# Altium schematic sheet CAN.SchDoc: Arm - CAN Transcievers
size Letter; DrawnBy: P.Onaifo, K.Hong; Organization: UW Robotics; Address1: 200 University Avenue; Address2: Waterloo; Address3: Ontario; Address4: Canada N2L 3G6; SheetNumber: 2; SheetTotal: 9
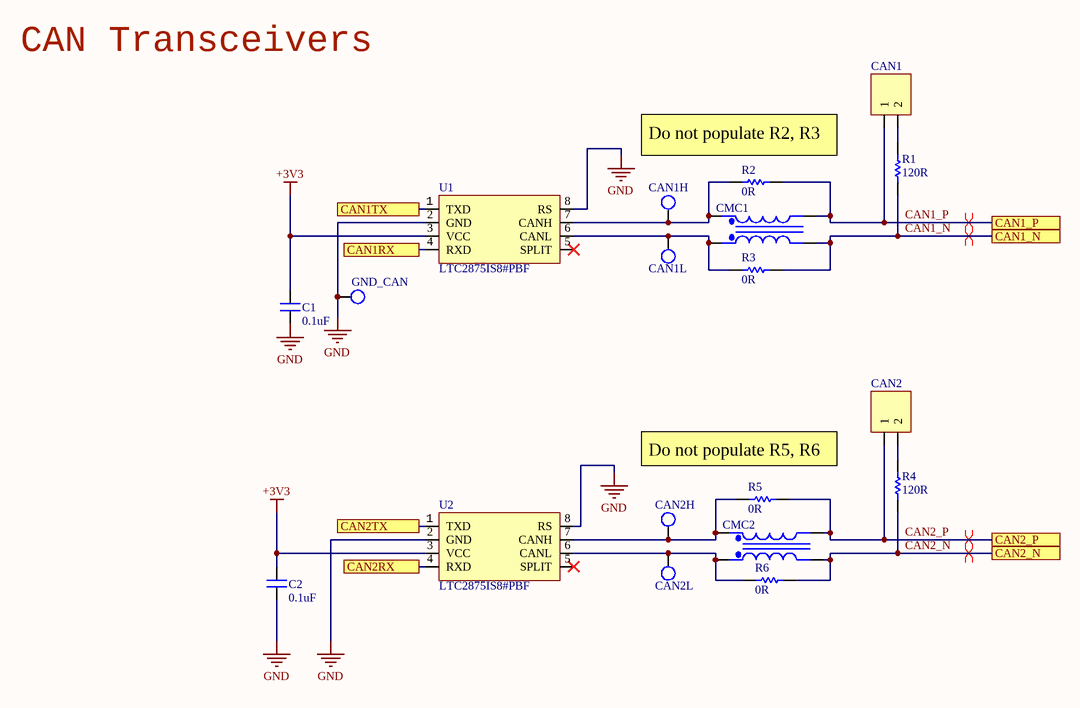
[diagram p0: CAN.SchDoc]

## Parts
C1  value 0.1uF  [CAPC0603(1608)55_N]  (hidden comment: CAP_0.1uF_50V_0603)
C2  value 0.1uF  [CAPC0603(1608)55_N]  (hidden comment: CAP_0.1uF_50V_0603)
CAN1  JUMPER_2  [HDR1X2]  (value not drawn)
CAN1H  TESTPOINT_LOOP  [TESTPOINT_LOOP]  (value not drawn)
CAN1L  TESTPOINT_LOOP  [TESTPOINT_LOOP]  (value not drawn)
CAN2  JUMPER_2  [HDR1X2]  (value not drawn)
CAN2H  TESTPOINT_LOOP  [TESTPOINT_LOOP]  (value not drawn)
CAN2L  TESTPOINT_LOOP  [TESTPOINT_LOOP]  (value not drawn)
CMC1  CMC  [DR331-513AE]  (value not drawn)
CMC2  CMC  [DR331-513AE]  (value not drawn)
GND_CAN  TESTPOINT_LOOP  [TESTPOINT_LOOP]  (value not drawn)
R1  value 120R  [RESC0603(1608)_N]  (hidden comment: RES_120R_0603)
R2  value 0R  [RESC0603(1608)_N]  (hidden comment: RES_0R_0603)
R3  value 0R  [RESC0603(1608)_N]  (hidden comment: RES_0R_0603)
R4  value 120R  [RESC0603(1608)_N]  (hidden comment: RES_120R_0603)
R5  value 0R  [RESC0603(1608)_N]  (hidden comment: RES_0R_0603)
R6  value 0R  [RESC0603(1608)_N]  (hidden comment: RES_0R_0603)
U1  MPN: LTC2875IS8#PBF  [LT-S8_N]  (hidden comment: IC TXRX CAN)
U2  MPN: LTC2875IS8#PBF  [LT-S8_N]  (hidden comment: IC TXRX CAN)

## Ports
CAN1_N, CAN1_P, CAN1RX, CAN1TX, CAN2_N, CAN2_P, CAN2RX, CAN2TX

## Nets
+3V3: C1.2 C2.2 U1.3(VCC) U2.3(VCC)
GND: C1.1 C2.1 GND_CAN.1 U1.2(GND) U1.8(RS) U2.2(GND) U2.8(RS)
CAN1_N: CMC1.3(Pri-) R1.1 R3.2 ; port CAN1_N
CAN1_P: CAN1.1 CMC1.4(Sec-) R2.2 ; port CAN1_P
CAN1RX: U1.4(RXD) ; port CAN1RX
CAN1TX: U1.1(TXD) ; port CAN1TX
CAN2_N: CMC2.3(Pri-) R4.1 R6.2 ; port CAN2_N
CAN2_P: CAN2.1 CMC2.4(Sec-) R5.2 ; port CAN2_P
CAN2RX: U2.4(RXD) ; port CAN2RX
CAN2TX: U2.1(TXD) ; port CAN2TX
NetCAN1_2: CAN1.2 R1.2
NetCAN1H_1: CAN1H.1 CMC1.1(Sec+) R2.1 U1.7(CANH)
NetCAN1L_1: CAN1L.1 CMC1.2(Pri+) R3.1 U1.6(CANL)
NetCAN2_2: CAN2.2 R4.2
NetCAN2H_1: CAN2H.1 CMC2.1(Sec+) R5.1 U2.7(CANH)
NetCAN2L_1: CAN2L.1 CMC2.2(Pri+) R6.1 U2.6(CANL)

Not connected (* = marked no-connect by the designer): U1 5(SPLIT)*; U2 5(SPLIT)*

## Layout directives
differential pair: CAN1_N, CAN1_P, CAN2_N, CAN2_P

## Notes on the sheet
- CAN Transceivers
- (near R2) Do not populate R2, R3
- Do not populate R5, R6
- Title
- Size:
- Date:
- Letter
- Drawn By:
- Sheet
- of
- File:

## Library data of the parts
C1 C2 = CAP_0.1uF_50V_0603: CAP CER 0.1UF 50V X7R 0603; MPN: CC0603KRX7R9BB104; Manufacturer: Yageo; Dimensions: 0.063" L x 0.031" W (1.60mm x 0.80mm); Package: 0603 (1608 Metric); Temperature Coefficient: X7R; Voltage Rating: 50V; Supplier Part Number 1: 311-1344-1-ND; Supplier 1: Digi-Key
CAN1 CAN2 = JUMPER_2: HEADER 2X1
CAN1H CAN1L CAN2H CAN2L GND_CAN = TESTPOINT_LOOP: Loop testpoint through-hole pad; Manufacturer: Keystone Electronics; Manufacturer Part Number 1: 5002; Supplier Part Number 1: 36-5002-ND; Supplier 1: Digi-Key
CMC1 CMC2 = CMC: Common Mode Choke; Supplier 1: Digi-Key; Supplier Part Number 1: DR331-513AECT-ND; Published: 8-Jun-2000; LatestRevisionDate: 17-Jul-2002; LatestRevisionNote: Re-released for DXP Platform.; PackageReference: TRF_5; Publisher: Altium Limited; PackageDescription: Transformer; 5 Leads
R1 R4 = RES_120R_0603: RES SMD 120 OHM 5% 1/10W 0603; Manufacturer: Yageo; MPN: RC0603JR-07120RL; Package: 0603 (1608 Metric); Dimensions: 0.063" L x 0.031" W (1.60mm x 0.80mm); Tolerance: 5%; Supplier Part Number 1: 311-120GRCT-ND; Supplier 1: Digi-Key
R2 R3 R5 R6 = RES_0R_0603: RES SMD 0 OHM JUMPER 1/10W 0603; Manufacturer: Yageo; MPN: RC0603JR-070RL; Package: 0603 (1608 Metric); Dimensions: 0.063" L x 0.031" W (1.60mm x 0.80mm); Supplier Part Number 1: 311-0.0GRCT-ND; Supplier 1: Digi-Key
U1 U2 = LTC2875: IC TXRX CAN 4MBPS 8SO; Manufacturer: Linear Technologies; Package: 8-SOIC (0.154", 3.90mm Width); ComponentLink1Description: Datasheet; ComponentLink1URL: https://www.analog.com/media/en/technical-documentation/data-sheets/2875f.pdf; Supplier Part Number 1: LTC2875IS8#PBF-ND; Supplier 1: Digi-Key